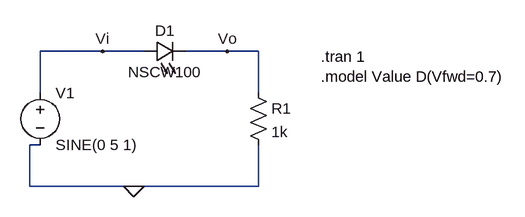
[diagram p0: schematic BasicDiode.asc]
BasicDiode.asc, the LTspice schematic file:
Version 4
SHEET 1 880 680
WIRE 0 176 -96 176
WIRE 64 176 0 176
WIRE 192 176 128 176
WIRE 240 176 192 176
WIRE -96 240 -96 176
WIRE 240 240 240 176
WIRE -96 320 -112 320
WIRE -112 384 -112 320
WIRE 48 384 -112 384
WIRE 240 384 240 320
WIRE 240 384 48 384
FLAG 48 384 0
FLAG 0 176 Vi
FLAG 192 176 Vo
SYMBOL voltage -96 224 R0
SYMATTR InstName V1
SYMATTR Value SINE(0 5 1)
SYMBOL LED 64 192 R270
WINDOW 0 32 32 VTop 2
WINDOW 3 0 32 VBottom 2
SYMATTR InstName D1
SYMATTR Value NSCW100
SYMATTR Description Diode
SYMATTR Type diode
SYMBOL res 224 224 R0
SYMATTR InstName R1
SYMATTR Value 1k
TEXT 336 184 Left 2 !.tran 1\n.model Value D(Vfwd=0.7)

The netlist it stands for:
* BasicDiode.asc
V1 Vi 0 SINE(0 5 1)
D1 Vi Vo NSCW100
R1 Vo 0 1k
.model D D
.lib standard.dio
.tran 1
.model Value D(Vfwd=0.7)
.backanno
.end